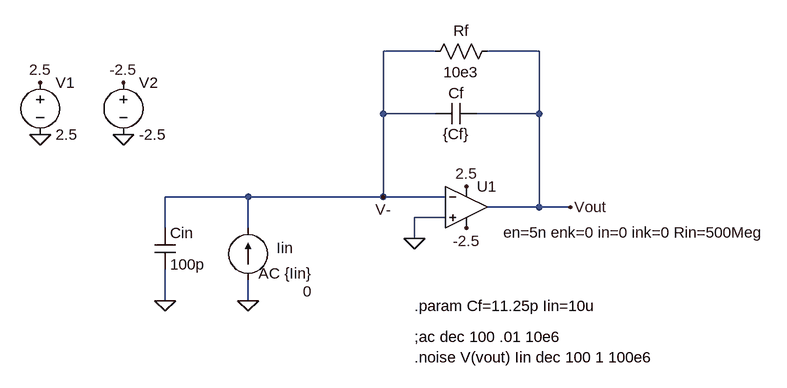
[diagram p0: schematic HW02.asc]
HW02.asc, the LTspice schematic file:
Version 4
SHEET 1 880 680
WIRE 176 -96 96 -96
WIRE 336 -96 256 -96
WIRE 96 0 96 -96
WIRE 176 0 96 0
WIRE 336 0 336 -96
WIRE 336 0 240 0
WIRE -112 128 -240 128
WIRE 96 128 96 0
WIRE 96 128 -112 128
WIRE 192 128 96 128
WIRE 336 144 336 0
WIRE 336 144 256 144
WIRE 384 144 336 144
WIRE 192 160 144 160
WIRE -240 176 -240 128
WIRE -112 176 -112 128
WIRE 144 192 144 160
WIRE -240 288 -240 240
WIRE -112 288 -112 256
FLAG 144 192 0
FLAG -240 288 0
FLAG -112 288 0
FLAG -432 -48 2.5
FLAG -304 -48 -2.5
FLAG -432 32 0
FLAG -304 32 0
FLAG 224 176 -2.5
FLAG 224 112 2.5
FLAG 384 144 Vout
FLAG 96 128 V-
SYMBOL res 272 -112 R90
WINDOW 0 0 56 VBottom 2
WINDOW 3 32 56 VTop 2
SYMATTR InstName Rf
SYMATTR Value 10e3
SYMBOL cap 240 -16 R90
WINDOW 0 0 32 VBottom 2
WINDOW 3 32 32 VTop 2
SYMATTR InstName Cf
SYMATTR Value {Cf}
SYMBOL cap -256 176 R0
SYMATTR InstName Cin
SYMATTR Value 100p
SYMBOL current -112 256 R180
WINDOW 0 -69 49 Left 2
WINDOW 3 -98 -18 Left 2
WINDOW 123 -98 10 Left 2
WINDOW 39 0 0 Left 0
SYMATTR InstName Iin
SYMATTR Value 0
SYMATTR Value2 AC {Iin}
SYMBOL voltage -432 -64 R0
WINDOW 123 0 0 Left 0
WINDOW 39 0 0 Left 0
SYMATTR InstName V1
SYMATTR Value 2.5
SYMBOL voltage -304 -64 R0
WINDOW 123 0 0 Left 0
WINDOW 39 0 0 Left 0
SYMATTR InstName V2
SYMATTR Value -2.5
SYMBOL OpAmps\\UniversalOpamp2 224 144 R0
WINDOW 40 57 39 Left 2
SYMATTR InstName U1
SYMATTR SpiceLine2 en=5n enk=0 in=0 ink=0 Rin=500Meg
TEXT 144 296 Left 2 !.param Cf=11.25p Iin=10u
TEXT 144 344 Left 2 !;ac dec 100 .01 10e6\n.noise V(vout) Iin dec 100 1 100e6

The netlist it stands for:
* HW02.asc
Rf Vout V- 10e3
Cf Vout V- {Cf}
Cin V- 0 100p
Iin 0 V- 0 AC {Iin}
V1 2.5 0 2.5
V2 -2.5 0 -2.5
XU1 0 V- 2.5 -2.5 Vout level.2 Avol=1Meg GBW=10Meg Slew=10Meg ilimit=25m rail=0 Vos=0 phimargin=45 en=5n enk=0 in=0 ink=0 Rin=500Meg  ; pins IN+ IN- V+ V- OUT
.param Cf=11.25p Iin=10u
;ac dec 100 .01 10e6
.noise V(vout) Iin dec 100 1 100e6
.lib UniversalOpamps2.sub
.backanno
.end